# EAGLE schematic motor_controller (EAGLE 6.5.0)

## Sheet 1 of 5: MCU
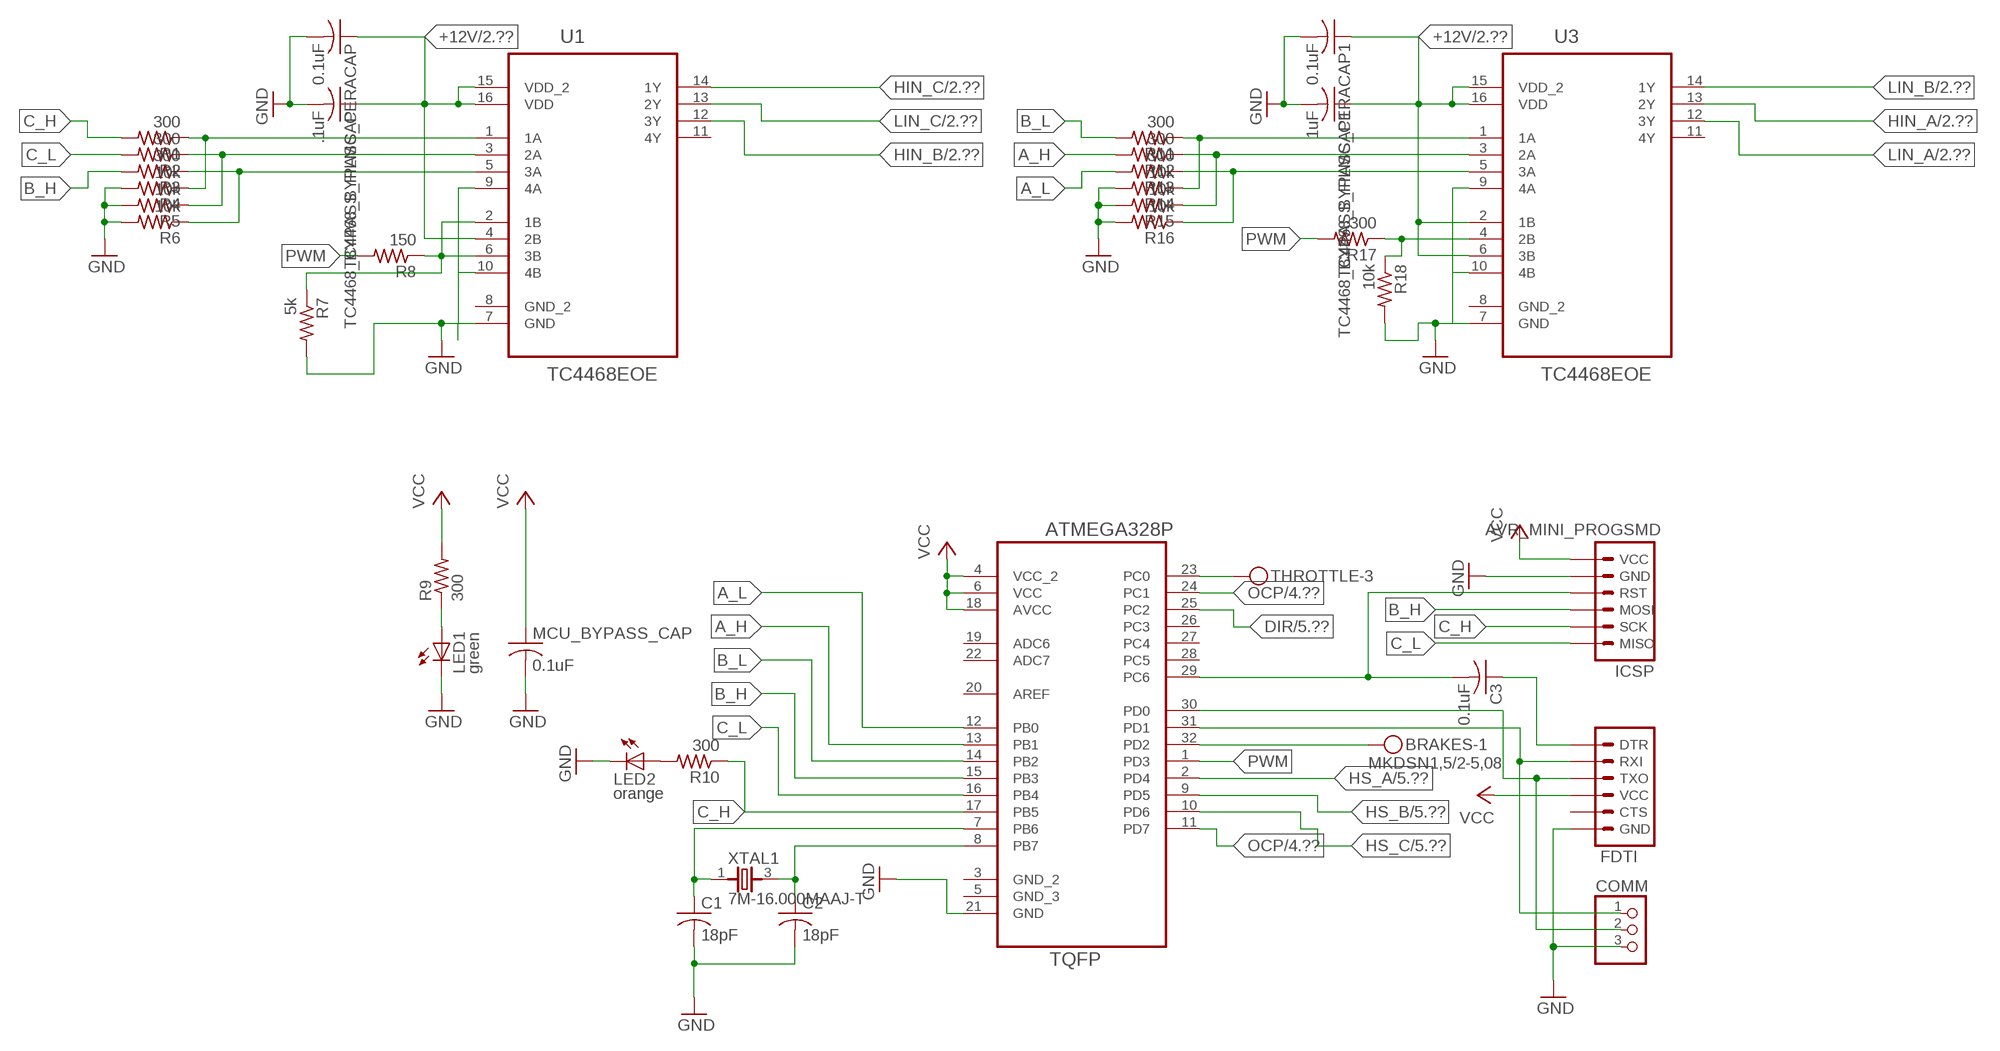
[diagram p0: schematic, sheet 1]

### Parts
BRAKES  MKDSN1,5/2-5,08  [MKDSN1,5/2-5,08]
C1  18pF  C-USC0805  [C0805]
C2  18pF  C-USC0805  [C0805]
C3  0.1uF  C-USC0805  [C0805]
COMM  PINHD-1X3  [1X03]
FDTI  ARDUINO_SERIAL_PROGRAMLONGPADS  [1X06_LONGPADS]
ICSP  AVR_MINI_PROGSMD  [AVR_MINI_PROG]
LED1  green  LEDCHIPLED_0805  [CHIPLED_0805]
LED2  orange  LEDCHIPLED_0805  [CHIPLED_0805]
MCU_BYPASS_CAP  0.1uF  C-USC0805  [C0805]
R1  300  R-US_R0805  [R0805]
R2  300  R-US_R0805  [R0805]
R3  300  R-US_R0805  [R0805]
R4  10k  R-US_R0805  [R0805]
R5  10k  R-US_R0805  [R0805]
R6  10k  R-US_R0805  [R0805]
R7  5k  R-US_R0805  [R0805]
R8  150  R-US_R0805  [R0805]
R9  300  R-US_R0805  [R0805]
R10  300  R-US_R0805  [R0805]
R11  300  R-US_R0805  [R0805]
R12  300  R-US_R0805  [R0805]
R13  300  R-US_R0805  [R0805]
R14  10k  R-US_R0805  [R0805]
R15  10k  R-US_R0805  [R0805]
R16  10k  R-US_R0805  [R0805]
R17  300  R-US_R0805  [R0805]
R18  10k  R-US_R0805  [R0805]
TC4468_BYPASS_CERACAP  0.1uF  C-USC0805  [C0805]
TC4468_BYPASS_CERACAP1  0.1uF  C-USC0805  [C0805]
TC4468_BYPASS_FILMCAP  .1uF  C-USC0805  [C0805]
TC4468_BYPASS_FILMCAP1  1uF  C-USC0805  [C0805]
THROTTLE  MKDSN1,5/3-5,08  [MKDSN1,5/3-5,08]
U1  TC4468EOE  [SOIC127P1030X265-16N]
U2  ATMEGA328P-AU  [QFP80P900X900X120-32N]
U3  TC4468EOE  [SOIC127P1030X265-16N]
XTAL1  7M-16.000MAAJ-T  [TXC_7M-16.000MAAJ-T]

### Nets
+12V: TC4468_BYPASS_CERACAP1.1 TC4468_BYPASS_CERACAP.1 TC4468_BYPASS_FILMCAP1.1 TC4468_BYPASS_FILMCAP.1 U1.4(2B) U1.15(VDD_2) U1.16(VDD) U3.2(1B) U3.6(3B) U3.15(VDD_2) U3.16(VDD) ; also sheet 2,5
A_H: R12.2 U2.13(PB1)
A_L: R13.2 U2.12(PB0)
B_H: ICSP.4(MOSI) R3.2 U2.15(PB3)
B_L: R11.2 U2.14(PB2)
C_H: ICSP.5(SCK) R1.2 R10.1 U2.17(PB5)
C_L: ICSP.6(MISO) R2.2 U2.16(PB4)
DIR: U2.25(PC2) ; also sheet 5
GND: C1.2 C2.2 COMM.3 FDTI.6(GND) ICSP.2(GND) LED1.C LED2.C MCU_BYPASS_CAP.2 R4.2 R5.2 R6.2 R7.2 R14.2 R15.2 R16.2 R18.2 TC4468_BYPASS_CERACAP1.2 TC4468_BYPASS_CERACAP.2 TC4468_BYPASS_FILMCAP1.2 TC4468_BYPASS_FILMCAP.2 U1.7(GND) U1.9(4A) U1.10(4B) U2.21(GND) U3.7(GND) U3.9(4A) U3.10(4B) ; also sheet 2,3,4,5
HIN_A: U3.13(2Y) ; also sheet 2
HIN_B: U1.12(3Y) ; also sheet 2
HIN_C: U1.14(1Y) ; also sheet 2
HS_A: U2.2(PD4) ; also sheet 5
HS_B: U2.9(PD5) ; also sheet 5
HS_C: U2.10(PD6) ; also sheet 5
LIN_A: U3.12(3Y) ; also sheet 2
LIN_B: U3.14(1Y) ; also sheet 2
LIN_C: U1.13(2Y) ; also sheet 2
N$1: LED1.A R9.1
N$3: LED2.A R10.2
N$4: C3.1 FDTI.1(DTR)
N$5: C3.2 ICSP.3(RST) U2.29(PC6)
N$6: COMM.2 FDTI.3(TXO) U2.30(PD0)
N$7: COMM.1 FDTI.2(RXI) U2.31(PD1)
N$8: R1.1 R4.1 U1.1(1A)
N$13: R2.1 R5.1 U1.3(2A)
N$15: R3.1 R6.1 U1.5(3A)
N$26: R11.1 R14.1 U3.1(1A)
N$27: R7.1 R8.1 U1.2(1B) U1.6(3B)
N$28: R12.1 R15.1 U3.3(2A)
N$29: R13.1 R16.1 U3.5(3A)
N$31: R17.1 R18.1 U3.4(2B)
N$43: BRAKES.1 U2.32(PD2)
OCP: U2.11(PD7) U2.24(PC1) ; also sheet 4
PWM: R8.2 R17.2 U2.1(PD3)
TRHOTTLE: THROTTLE.3 U2.23(PC0)
VCC: FDTI.4(VCC) ICSP.1(VCC) MCU_BYPASS_CAP.1 R9.2 U2.4(VCC_2) U2.6(VCC) U2.18(AVCC) ; also sheet 4,5
XTAL1: C2.1 U2.8(PB7) XTAL1.3
XTAL2: C1.1 U2.7(PB6) XTAL1.1
Unconnected: FDTI.5(CTS) U1.8(GND_2) U1.11(4Y) U2.3(GND_2) U2.5(GND_3) U2.19(ADC6) U2.20(AREF) U2.22(ADC7) U2.26(PC3) U2.27(PC4) U2.28(PC5) U3.8(GND_2) U3.11(4Y)

## Sheet 2 of 5: GATE DRIVERS
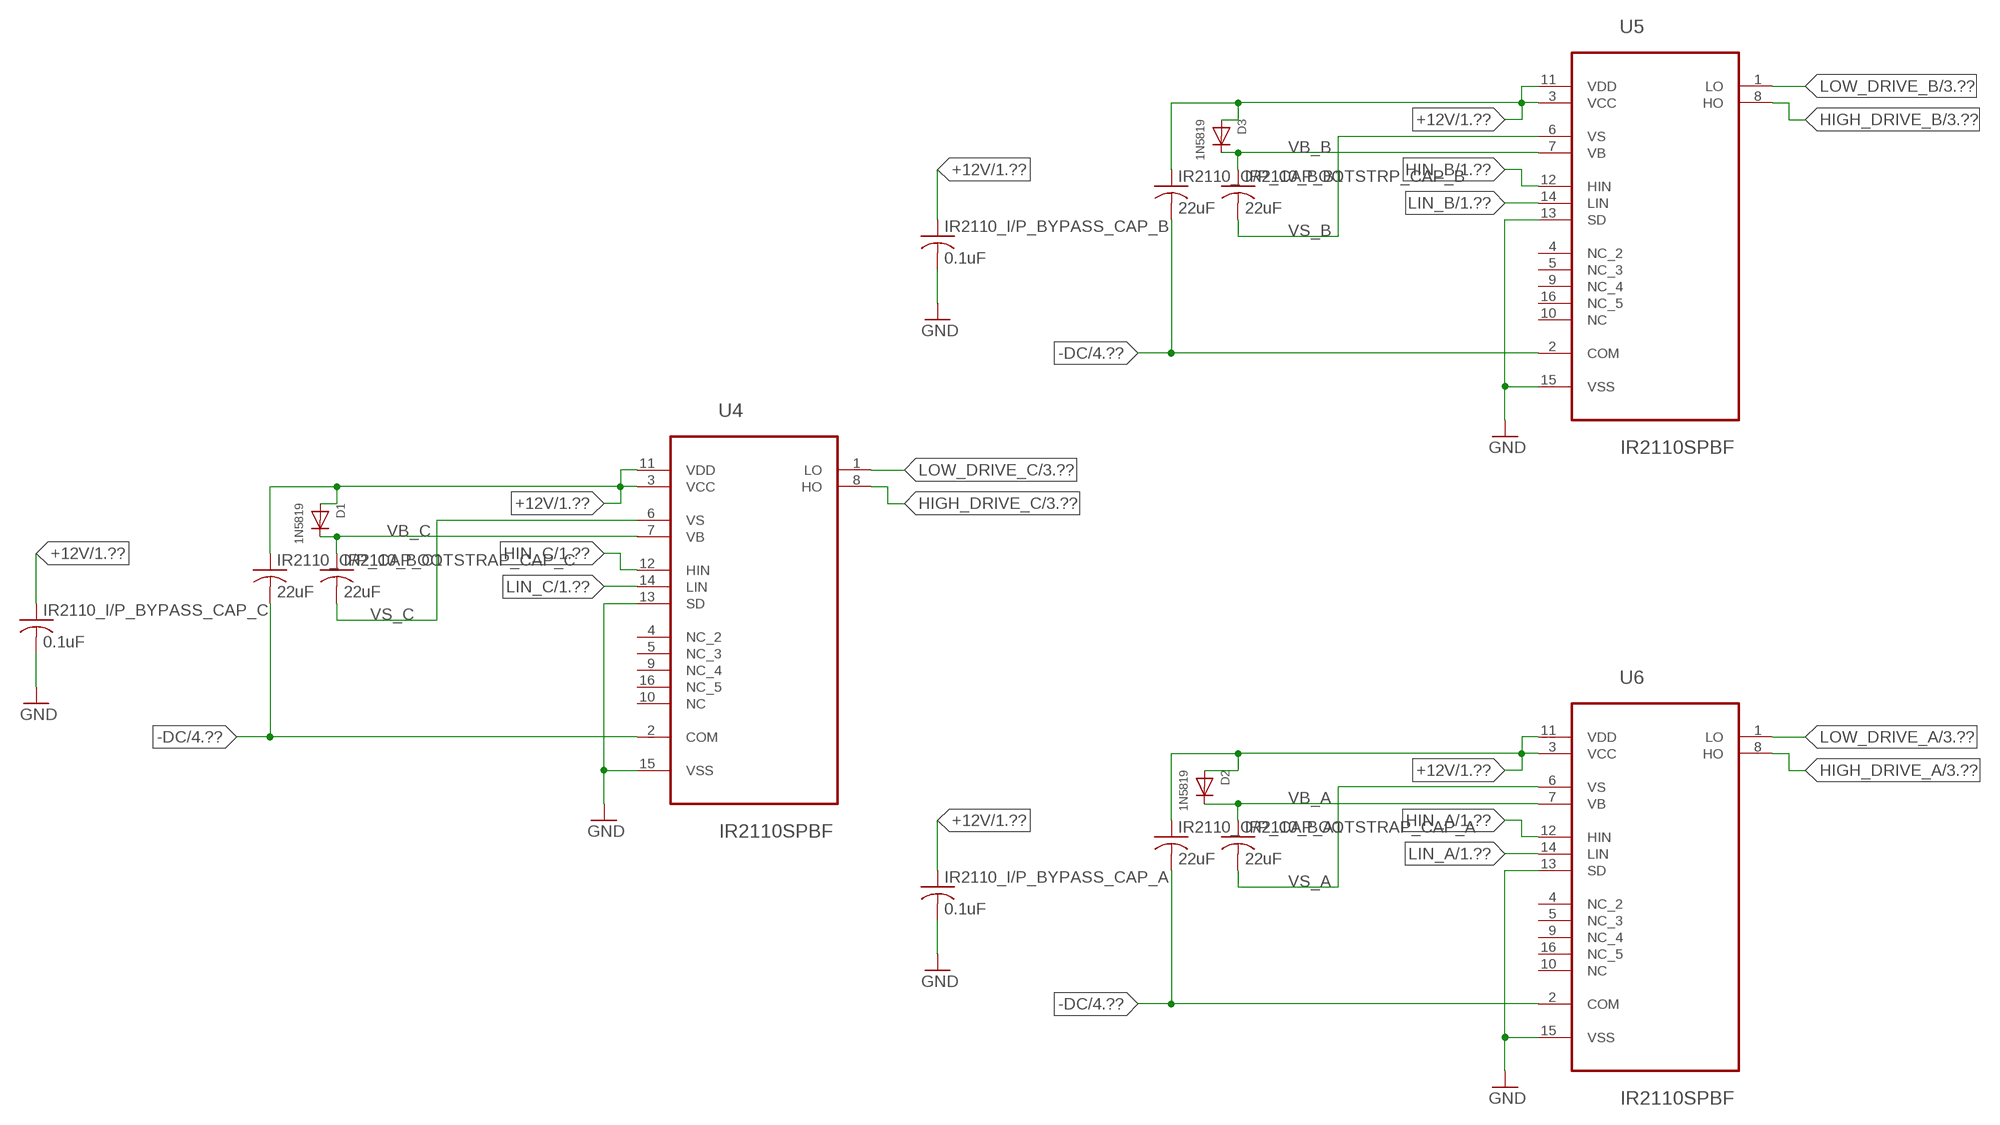
[diagram p1: schematic, sheet 2]

### Parts
D1  1N5819  DIODESOD-123  [SOD-123]
D2  1N5819  DIODESOD-123  [SOD-123]
D3  1N5819  DIODESOD-123  [SOD-123]
IR2110_BOOTSTRAP_CAP_A  22uF  C2917  [C2917]
IR2110_BOOTSTRAP_CAP_C  22uF  C2917  [C2917]
IR2110_BOOTSTRP_CAP_B  22uF  C2917  [C2917]
IR2110_I/P_BYPASS_CAP_A  0.1uF  C-USC0805  [C0805]
IR2110_I/P_BYPASS_CAP_B  0.1uF  C-USC0805  [C0805]
IR2110_I/P_BYPASS_CAP_C  0.1uF  C-USC0805  [C0805]
IR2110_O/P_CAP_A1  22uF  C2917  [C2917]
IR2110_O/P_CAP_B1  22uF  C2917  [C2917]
IR2110_O/P_CAP_C1  22uF  C2917  [C2917]
U4  IR2110SPBF  [SOIC127P1030X265-16N]
U5  IR2110SPBF  [SOIC127P1030X265-16N]
U6  IR2110SPBF  [SOIC127P1030X265-16N]

### Nets
+12V: D1.A D2.A D3.A IR2110_I/P_BYPASS_CAP_A.1 IR2110_I/P_BYPASS_CAP_B.1 IR2110_I/P_BYPASS_CAP_C.1 IR2110_O/P_CAP_A1.P$1 IR2110_O/P_CAP_B1.P$1 IR2110_O/P_CAP_C1.P$1 U4.3(VCC) U4.11(VDD) U5.3(VCC) U5.11(VDD) U6.3(VCC) U6.11(VDD) ; also sheet 1,5
-DC: IR2110_O/P_CAP_A1.P$2 IR2110_O/P_CAP_B1.P$2 IR2110_O/P_CAP_C1.P$2 U4.2(COM) U5.2(COM) U6.2(COM) ; also sheet 3,4
GND: IR2110_I/P_BYPASS_CAP_A.2 IR2110_I/P_BYPASS_CAP_B.2 IR2110_I/P_BYPASS_CAP_C.2 U4.13(SD) U4.15(VSS) U5.13(SD) U5.15(VSS) U6.13(SD) U6.15(VSS) ; also sheet 1,3,4,5
HIGH_DRIVE_A: U6.8(HO) ; also sheet 3
HIGH_DRIVE_B: U5.8(HO) ; also sheet 3
HIGH_DRIVE_C: U4.8(HO) ; also sheet 3
HIN_A: U6.12(HIN) ; also sheet 1
HIN_B: U5.12(HIN) ; also sheet 1
HIN_C: U4.12(HIN) ; also sheet 1
LIN_A: U6.14(LIN) ; also sheet 1
LIN_B: U5.14(LIN) ; also sheet 1
LIN_C: U4.14(LIN) ; also sheet 1
LOW_DRIVE_A: U6.1(LO) ; also sheet 3
LOW_DRIVE_B: U5.1(LO) ; also sheet 3
LOW_DRIVE_C: U4.1(LO) ; also sheet 3
VB_A: D2.C IR2110_BOOTSTRAP_CAP_A.P$1 U6.7(VB)
VB_B: D3.C IR2110_BOOTSTRP_CAP_B.P$1 U5.7(VB)
VB_C: D1.C IR2110_BOOTSTRAP_CAP_C.P$1 U4.7(VB)
VS_A: IR2110_BOOTSTRAP_CAP_A.P$2 U6.6(VS) ; also sheet 3,5
VS_B: IR2110_BOOTSTRP_CAP_B.P$2 U5.6(VS) ; also sheet 3,5
VS_C: IR2110_BOOTSTRAP_CAP_C.P$2 U4.6(VS) ; also sheet 3,5
Unconnected: U4.4(NC_2) U4.5(NC_3) U4.9(NC_4) U4.10(NC) U4.16(NC_5) U5.4(NC_2) U5.5(NC_3) U5.9(NC_4) U5.10(NC) U5.16(NC_5) U6.4(NC_2) U6.5(NC_3) U6.9(NC_4) U6.10(NC) U6.16(NC_5)

## Sheet 3 of 5: INVERTER BRIDGE
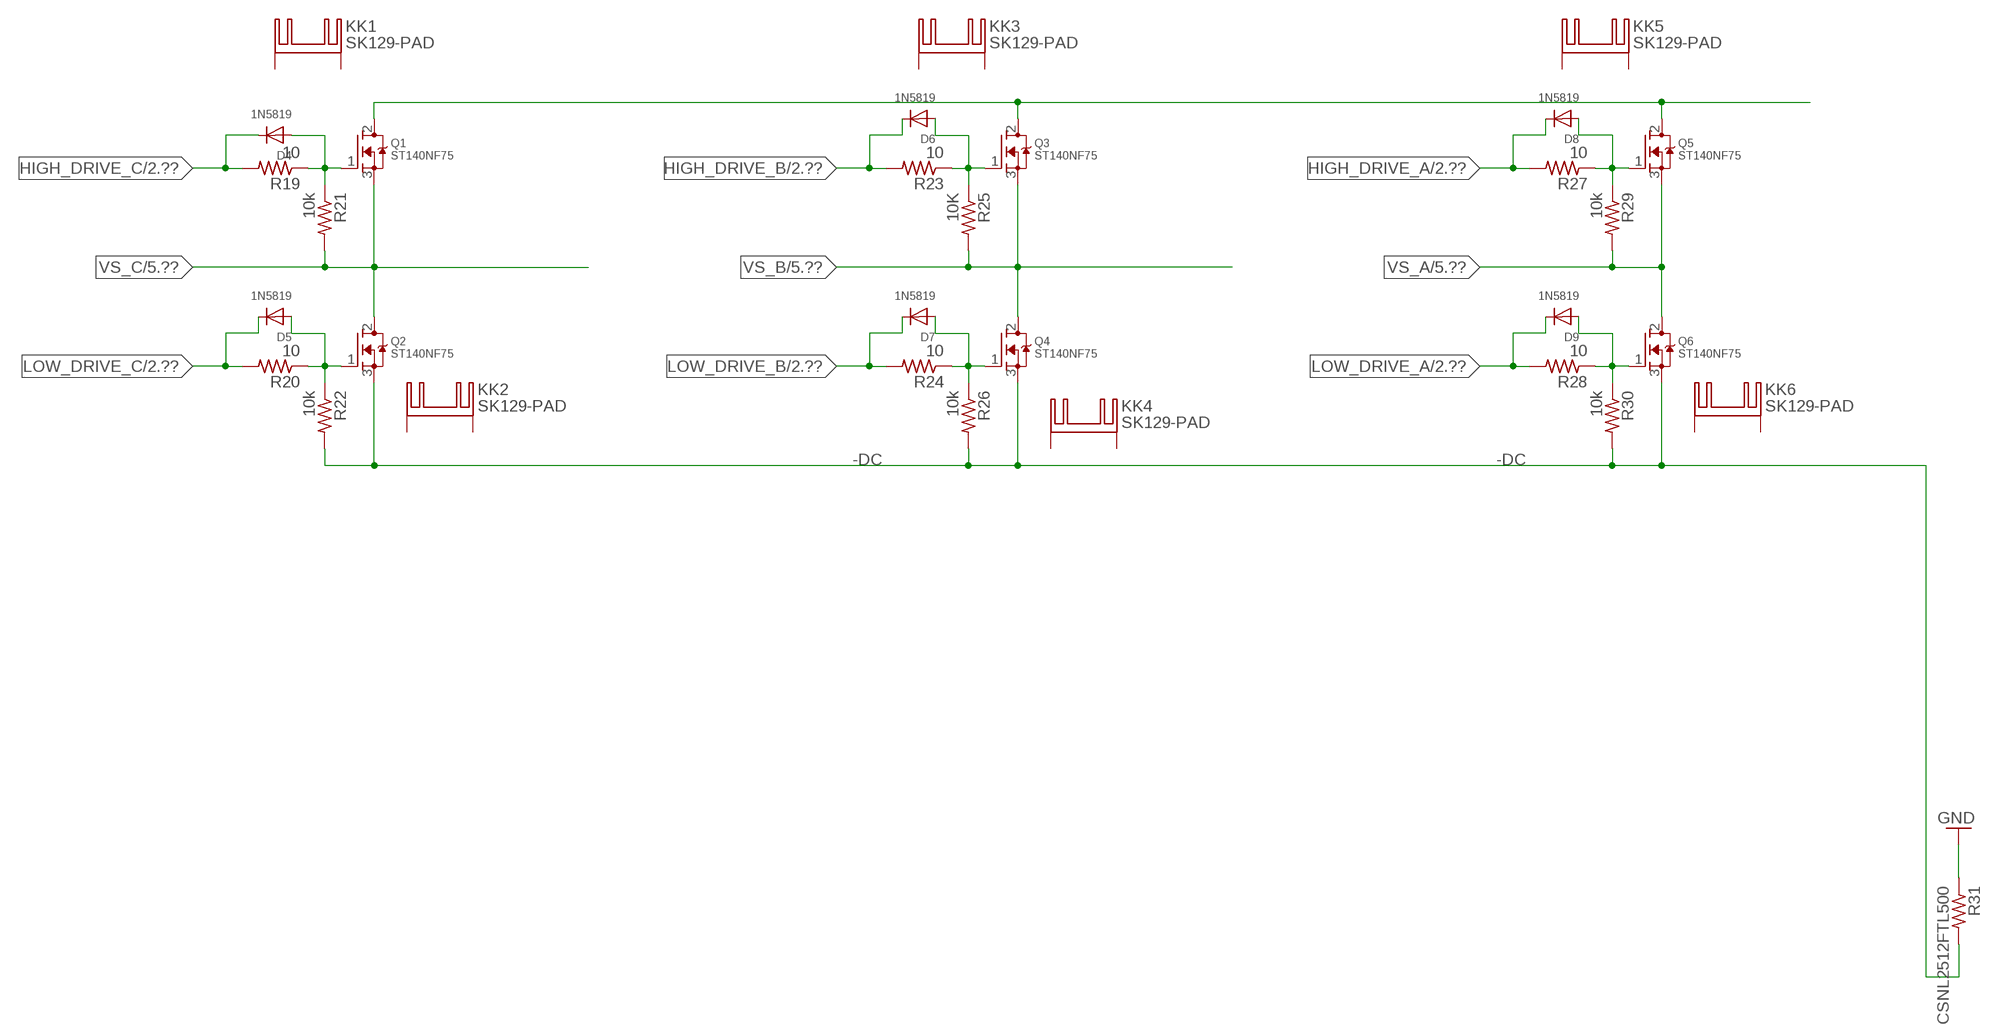
[diagram p2: schematic, sheet 3]

### Parts
D4  1N5819  DIODESOD-123  [SOD-123]
D5  1N5819  DIODESOD-123  [SOD-123]
D6  1N5819  DIODESOD-123  [SOD-123]
D7  1N5819  DIODESOD-123  [SOD-123]
D8  1N5819  DIODESOD-123  [SOD-123]
D9  1N5819  DIODESOD-123  [SOD-123]
KK1  SK129-PAD  [SK129]
KK2  SK129-PAD  [SK129]
KK3  SK129-PAD  [SK129]
KK4  SK129-PAD  [SK129]
KK5  SK129-PAD  [SK129]
KK6  SK129-PAD  [SK129]
Q1  ST140NF75  MOSFET-NGDS_TO220V  [TO220V]
Q2  ST140NF75  MOSFET-NGDS_TO220V  [TO220V]
Q3  ST140NF75  MOSFET-NGDS_TO220V  [TO220V]
Q4  ST140NF75  MOSFET-NGDS_TO220V  [TO220V]
Q5  ST140NF75  MOSFET-NGDS_TO220V  [TO220V]
Q6  ST140NF75  MOSFET-NGDS_TO220V  [TO220V]
R19  10  R-US_R0805  [R0805]
R20  10  R-US_R0805  [R0805]
R21  10k  R-US_R0805  [R0805]
R22  10k  R-US_R0805  [R0805]
R23  10  R-US_R0805  [R0805]
R24  10  R-US_R0805  [R0805]
R25  10K  R-US_R0805  [R0805]
R26  10k  R-US_R0805  [R0805]
R27  10  R-US_R0805  [R0805]
R28  10  R-US_R0805  [R0805]
R29  10k  R-US_R0805  [R0805]
R30  10k  R-US_R0805  [R0805]
R31  CSNL2512FTL500  R-US_R2512  [R2512]

### Nets
+DC: Q1.2(D) Q3.2(D) Q5.2(D) ; also sheet 5
-DC: Q2.3(S) Q4.3(S) Q6.3(S) R22.2 R26.2 R30.2 R31.2 ; also sheet 2,4
GND: R31.1 ; also sheet 1,2,4,5
HIGH_DRIVE_A: D8.C R27.2 ; also sheet 2
HIGH_DRIVE_B: D6.C R23.2 ; also sheet 2
HIGH_DRIVE_C: D4.C R19.2 ; also sheet 2
LOW_DRIVE_A: D9.C R28.2 ; also sheet 2
LOW_DRIVE_B: D7.C R24.2 ; also sheet 2
LOW_DRIVE_C: D5.C R20.2 ; also sheet 2
N$35: D4.A Q1.1(G) R19.1 R21.1
N$38: D6.A Q3.1(G) R23.1 R25.1
N$41: D8.A Q5.1(G) R27.1 R29.1
N$44: D5.A Q2.1(G) R20.1 R22.1
N$47: D7.A Q4.1(G) R24.1 R26.1
N$50: D9.A Q6.1(G) R28.1 R30.1
VS_A: Q5.3(S) Q6.2(D) R29.2 ; also sheet 2,5
VS_B: Q3.3(S) Q4.2(D) R25.2 ; also sheet 2,5
VS_C: Q1.3(S) Q2.2(D) R21.2 ; also sheet 2,5
Unconnected: KK1.A2,5(K) KK1.B2,5(K) KK2.A2,5(K) KK2.B2,5(K) KK3.A2,5(K) KK3.B2,5(K) KK4.A2,5(K) KK4.B2,5(K) KK5.A2,5(K) KK5.B2,5(K) KK6.A2,5(K) KK6.B2,5(K)

## Sheet 4 of 5: ANALOG COMPARATOR
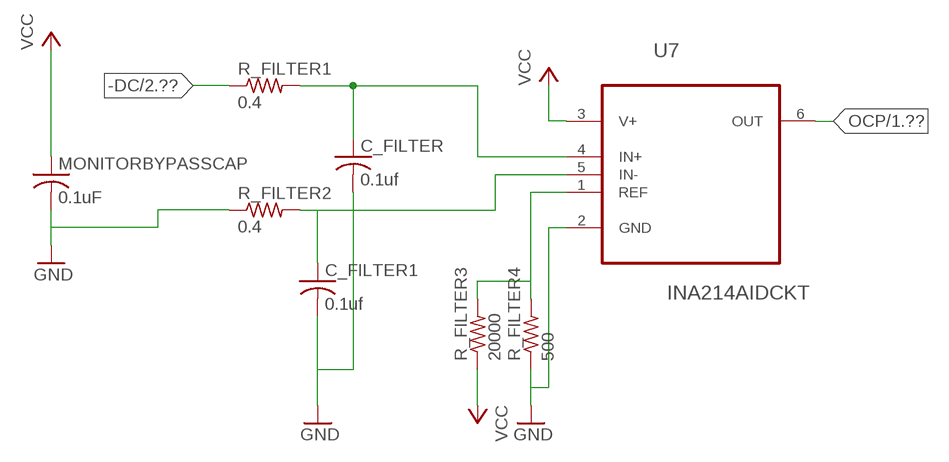
[diagram p3: schematic, sheet 4]

### Parts
C_FILTER  0.1uf  C-USC0603  [C0603]
C_FILTER1  0.1uf  C-USC0603  [C0603]
MONITORBYPASSCAP  0.1uF  C-USC0805  [C0805]
R_FILTER1  0.4  R-US_R0603  [R0603]
R_FILTER2  0.4  R-US_R0603  [R0603]
R_FILTER3  20000  R-US_R0805  [R0805]
R_FILTER4  500  R-US_R0805  [R0805]
U7  INA214AIDCKT  [SOT65P210X110-6N]

### Nets
-DC: R_FILTER1.1 ; also sheet 2,3
GND: C_FILTER1.2 C_FILTER.2 MONITORBYPASSCAP.2 R_FILTER2.1 R_FILTER4.1 U7.2(GND) ; also sheet 1,2,3,5
N$10: R_FILTER3.2 R_FILTER4.2 U7.1(REF)
N$11: C_FILTER1.1 R_FILTER2.2 U7.5(IN-)
N$39: C_FILTER.1 R_FILTER1.2 U7.4(IN+)
OCP: U7.6(OUT) ; also sheet 1
VCC: MONITORBYPASSCAP.1 R_FILTER3.1 U7.3(V+) ; also sheet 1,5

## Sheet 5 of 5: POWER SUPPLY
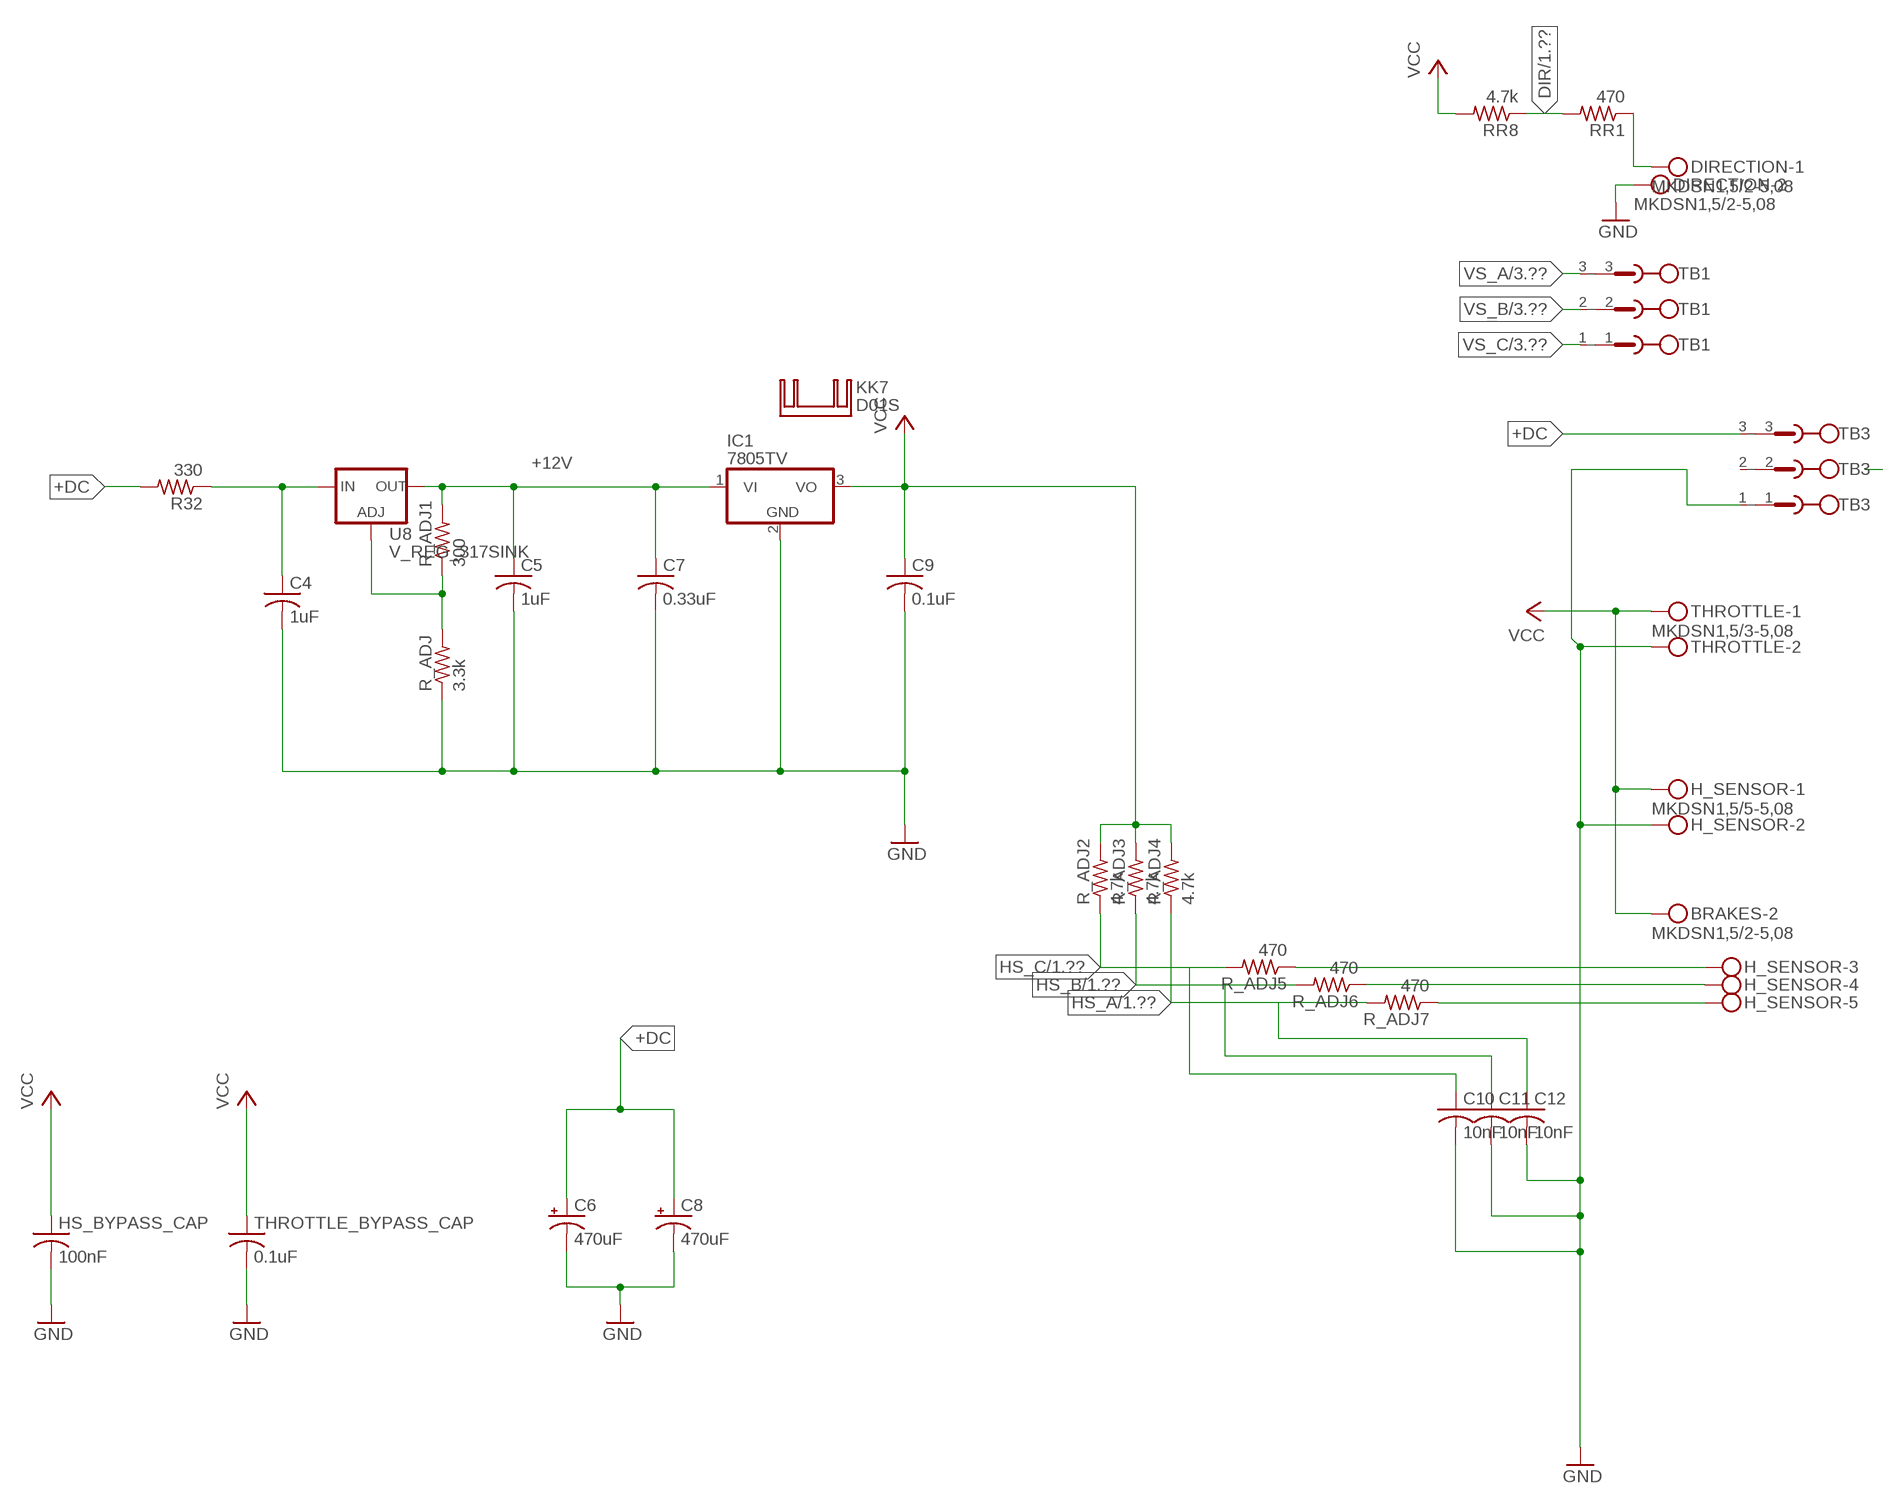
[diagram p4: schematic, sheet 5]

### Parts
C4  1uF  C-USC0805  [C0805]
C5  1uF  C-USC0805  [C0805]
C6  470uF  1000UF-25V(PTH)  [CPOL-RADIAL-1000UF-25V]
C7  0.33uF  C-USC0805  [C0805]
C8  470uF  1000UF-25V(PTH)  [CPOL-RADIAL-1000UF-25V]
C9  0.1uF  C-USC0805  [C0805]
C10  10nF  C-USC0805  [C0805]
C11  10nF  C-USC0805  [C0805]
C12  10nF  C-USC0805  [C0805]
DIRECTION  MKDSN1,5/2-5,08  [MKDSN1,5/2-5,08]
H_SENSOR  MKDSN1,5/5-5,08  [MKDSN1,5/5-5,08]
HS_BYPASS_CAP  100nF  C-USC0805  [C0805]
IC1  7805TV  [TO220V]
KK7  D01S  [D01S]
R32  330  R-US_R2512  [R2512]
R_ADJ  3.3k  R-US_R0805  [R0805]
R_ADJ1  300  R-US_R0805  [R0805]
R_ADJ2  4.7k  R-US_R0805  [R0805]
R_ADJ3  4.7k  R-US_R0805  [R0805]
R_ADJ4  4.7k  R-US_R0805  [R0805]
R_ADJ5  470  R-US_R0805  [R0805]
R_ADJ6  470  R-US_R0805  [R0805]
R_ADJ7  470  R-US_R0805  [R0805]
RR1  470  R-US_R0805  [R0805]
RR8  4.7k  R-US_R0805  [R0805]
TB1  MKDSP 10N/ 3-10,16  MKDSP10N/3-10,16  [MKDSP10N/3-10,16]
TB3  MKDSP 10N/ 3-10,16  MKDSP10N/3-10,16  [MKDSP10N/3-10,16]
THROTTLE_BYPASS_CAP  0.1uF  C-USC0805  [C0805]
U8  V_REG_317SINK  [TO220-ADJ]

### Nets
+12V: C5.1 C7.1 IC1.1(VI) R_ADJ1.2 U8.OUT ; also sheet 1,2
+DC: C6.+ C8.+ R32.2 TB3.3_ ; also sheet 3
DIR: RR1.2 RR8.1 ; also sheet 1
GND: C4.2 C5.2 C6.- C7.2 C8.- C9.2 C10.2 C11.2 C12.2 DIRECTION.2 H_SENSOR.2 HS_BYPASS_CAP.2 IC1.2(GND) R_ADJ.1 TB3.1_ THROTTLE.2 THROTTLE_BYPASS_CAP.2 ; also sheet 1,2,3,4
HS_A: C12.1 R_ADJ4.1 R_ADJ7.2 ; also sheet 1
HS_B: C11.1 R_ADJ3.1 R_ADJ6.2 ; also sheet 1
HS_C: C10.1 R_ADJ2.1 R_ADJ5.2 ; also sheet 1
N$2: DIRECTION.1 RR1.1
N$36: H_SENSOR.3 R_ADJ5.1
N$37: H_SENSOR.4 R_ADJ6.1
N$42: H_SENSOR.5 R_ADJ7.1
N$46: R_ADJ1.1 R_ADJ.2 U8.ADJ
N$48: C4.1 R32.1 U8.IN
VCC: BRAKES.2 C9.1 H_SENSOR.1 HS_BYPASS_CAP.1 IC1.3(VO) R_ADJ2.2 R_ADJ3.2 R_ADJ4.2 RR8.2 THROTTLE.1 THROTTLE_BYPASS_CAP.1 ; also sheet 1,4
VS_A: TB1.3_ ; also sheet 2,3
VS_B: TB1.2_ ; also sheet 2,3
VS_C: TB1.1_ ; also sheet 2,3
Unconnected: TB1.1 TB1.2 TB1.3 TB3.1 TB3.2 TB3.2_ TB3.3

## Library data of the parts
BRAKES DIRECTION = con-phoenix-508:MKDSN1,5/2-5,08: MKDSN 1,5/ 2-5,08 Printklemme Nennstrom: 13,5 A Nennspannung: 250 V Rastermaß: 5,08 mm Polzahl: 2 Anschlussart: Schraubanschluss Montage: Löten Anschlussrichtung Leiter/Platine: 0 ° Artikelnummer: 1729128 Source: http://eshop.phoenixcontact.com .. 1729128.pdf; MPN: MKDSN 1,5/2-5.08; OC_FARNELL: 1792903; OC_NEWARK: 30M2397
C1-C5 C7 C9-C12 HS_BYPASS_CAP IR2110_I/P_BYPASS_CAP_A IR2110_I/P_BYPASS_CAP_B IR2110_I/P_BYPASS_CAP_C MCU_BYPASS_CAP MONITORBYPASSCAP TC4468_BYPASS_CERACAP TC4468_BYPASS_CERACAP1 TC4468_BYPASS_FILMCAP TC4468_BYPASS_FILMCAP1 THROTTLE_BYPASS_CAP = adafruit:C-US: CAPACITOR, American symbol
C6 C8 = SparkFun-Capacitors:1000UF-25V(PTH): CAP-08070; PROD_ID: CAP-09538; VALUE: CAP-09538
C_FILTER C_FILTER1 = resistor:C-US: CAPACITOR, American symbol
COMM = adafruit:PINHD-1X3: PIN HEADER
D1-D9 = adafruit:DIODE: Diode SMADIODE - SMA Surface Mount Package 20V 1A Schottky Diode Digikey: 641-1014-6-ND DO-1N4148 - Through Hole Small Current Diode SOD-123 20V 1 A (.5mV Vf) Schottky Diode - Digikey: MBRX120TPMSCT-ND SOD-323 10V 570mA (.38mV Vf, 3ns) Schottky Diode - Digikey: ZLLS410CT-ND SOD-523 30V 30mA Schottky Diode (RB751S-40TE61) - Digikey: RB751S-40TE61CT-ND SOT23-R/W - SOT23 Package (R = Solder Paste/Reflow Ovens, W = Hand-Soldering) BAT54Film 40V 300mA - Digikey: 497-7162-1-ND
FDTI = SparkFun-Connectors:ARDUINO_SERIAL_PROGRAM: FTDI connector footprints
H_SENSOR = con-phoenix-508:MKDSN1,5/5-5,08: MKDSN 1,5/ 5-5,08 Printklemme Nennstrom: 13,5 A Nennspannung: 250 V Rastermaß: 5,08 mm Polzahl: 5 Anschlussart: Schraubanschluss Montage: Löten Anschlussrichtung Leiter/Platine: 0 ° Artikelnummer: 1729157 Source: http://eshop.phoenixcontact.com .. 1729157.pdf; MPN: SMKDSN1,5/5-5,08; OC_FARNELL: 1792906; OC_NEWARK: 70R0301
IC1 = linear:78*: Positive VOLTAGE REGULATOR Source: http://cache.national.com/ds/LM/LM78L05.pdf http://www.fairchildsemi.com/ds/LM/LM7805.pdf
ICSP = SparkFun-Connectors:AVR_MINI_PROG: AVR ISP 6-pin inline header
IR2110_BOOTSTRAP_CAP_A IR2110_BOOTSTRAP_CAP_C IR2110_BOOTSTRP_CAP_B IR2110_O/P_CAP_A1 IR2110_O/P_CAP_B1 IR2110_O/P_CAP_C1 = resistor:C2917
KK1-KK6 = heatsink:SK129-PAD: HEATSINK manufacturer Fischer/distributor Buerklin
KK7 = heatsink:D01S: HEATSINK distributor Schukat
LED1 LED2 = adafruit:LED: LED OSRAM: - CHIPLED LG R971, LG N971, LY N971, LG Q971, LY Q971, LO R971, LY R971 LH N974, LH R974 LS Q976, LO Q976, LY Q976 LO Q996 - Hyper CHIPLED LW Q18S LB Q993, LB Q99A, LB R99A - SideLED LS A670, LO A670, LY A670, LG A670, LP A670 LB A673, LV A673, LT A673, LW A673 LH A674 LY A675 LS A676, LA A676, LO A676, LY A676, LW A676 LS A679, LY A679, LG A679 - Hyper Micro SIDELED® LS Y876, LA Y876, LO Y876, LY Y876 LT Y87S - SmartLED LW L88C, LW L88S LB L89C, LB L89S, LG L890 LS L89K, LO L89K, LY L89K LS L896, LA L896, LO L896, LY L896 - TOPLED LS T670, LO T670, LY T670, LG T670, LP T670 LSG T670, LSP T670, LSY T670, LOP T670, LYG T670 LG T671, LOG T671, LSG T671 LB T673, LV T673, LT T673, LW T673 LH T674 LS T676, LA T676, LO T676, LY T676, LB T676, LH T676, LSB T676, LW T676 LB T67C, LV T67C, LT T67C, LS T67K, LO T67K, LY T67K, LW E67C LS E67B, LA E67B, LO E67B, LY E67B, LB E67C, LV E67C, LT E67C LW T67C LS T679, LY T679, LG T679 LS T770, LO T770, LY T770, LG T770, LP T770 LB T773, LV T773, LT T773, LW T773 LH T774 LS E675, LA E675, LY E675, LS T675 LS T776, LA T776, LO T776, LY T776, LB T776 LHGB T686 LT T68C, LB T68C - Hyper Mini TOPLED® LB M676 - Mini TOPLED Santana® LG M470 LS M47K, LO M47K, LY M47K Source: http://www.osram.convergy.de/
Q1-Q6 = adafruit:MOSFET-N: N-Channel Mosfet 2N7002E - 60V 260mA SOT23 [Digikey: 2N7002ET1GOSTR-ND] - REEL BSH103 - 30V 850mA SOT23 [Digikey: 568-5013-1-ND]
R1-R31 R_ADJ R_ADJ1-R_ADJ7 R_FILTER3 R_FILTER4 RR1 RR8 = adafruit:R-US_: RESISTOR, American symbol
R32 R_FILTER1 R_FILTER2 = resistor:R-US_: RESISTOR, American symbol
TB1 TB3 = con-phoenix-508:MKDSP10N/3-10,16: PC terminal block, Nominal current: 76 A, Nom. voltage: 1000 V, Pitch: 10.16 mm, Number of positions: 3. 1774137-ND 277-6019 MKDSP 10N/ 3-10,16 MKDSP10N/3-10,16
THROTTLE = con-phoenix-508:MKDSN1,5/3-5,08: MKDSN 1,5/ 3-5,08 Printklemme Nennstrom: 13,5 A Nennspannung: 250 V Rastermaß: 5,08 mm Polzahl: 3 Anschlussart: Schraubanschluss Montage: Löten Anschlussrichtung Leiter/Platine: 0 ° Artikelnummer: 1729131 Source: http://eshop.phoenixcontact.com .. 1729131.pdf; MPN: SMKDSN1,5/3-5,08; OC_FARNELL: 1792904; OC_NEWARK: 70R0299
U1 U3 = Microchip-TC44xx:TC44: IC, MOSFET DRIVER, LOW-SIDE,SOIC-16 Wide; MPN: TC4468EOE; OC_FARNELL: 1840858; OC_NEWARK: 56J8344; PACKAGE: SOIC-16 Wide; SUPPLIER: MICROCHIP
U2 = Ava:ATMEGA328P-AU; DESCRIPTION: 8-bit Microcontroller with In-System Programmable Flash; MPN: ATMEGA328P-AU; OC_FARNELL: 1715486; OC_NEWARK: 14R4631; PACKAGE: TQFP-32; SUPPLIER: Atmel
U4-U6 = GateDriver:IR2110SPBF: HIGH AND LOW SIDE DRIVER; MPN: IR2110SPBF; OC_FARNELL: 8638845; OC_NEWARK: 63J7860; PACKAGE: SOIC-16; SUPPLIER: International Rectifier
U7 = Amplifier:INA214AIDCKT: CURRENT SHUNT MONITOR; MPN: INA214AIDCKT; OC_FARNELL: 1754262; OC_NEWARK: 05N1041; PACKAGE: SC-70-6; SUPPLIER: Texas Instruments
U8 = SparkFun-PowerIC:V_REG_317: Voltage Regulator Standard LM317 adjustable voltage regulator. AOI (Adjust Output Input). Google 'LM317 Calculator' for easy to use app to get the two resistor values needed. 240/720 for 5V output. 240/390 for 3.3V output. Spark Fun Electronics SKU : COM-00527
XTAL1 = TXC-7M-16.000MAAJ-T:7M-16.000MAAJ-T: CRYSTAL SEAM, 16MHZ, 18PF, SMD; MPN: 7M-16.000MAAJ-T; OC_FARNELL: 1842060; OC_NEWARK: 84R5710; PACKAGE: SMD; SUPPLIER: TXC

## Net classes
1 +DC: width 1.27 mm, drill 0.635 mm, clearance 0.635 mm